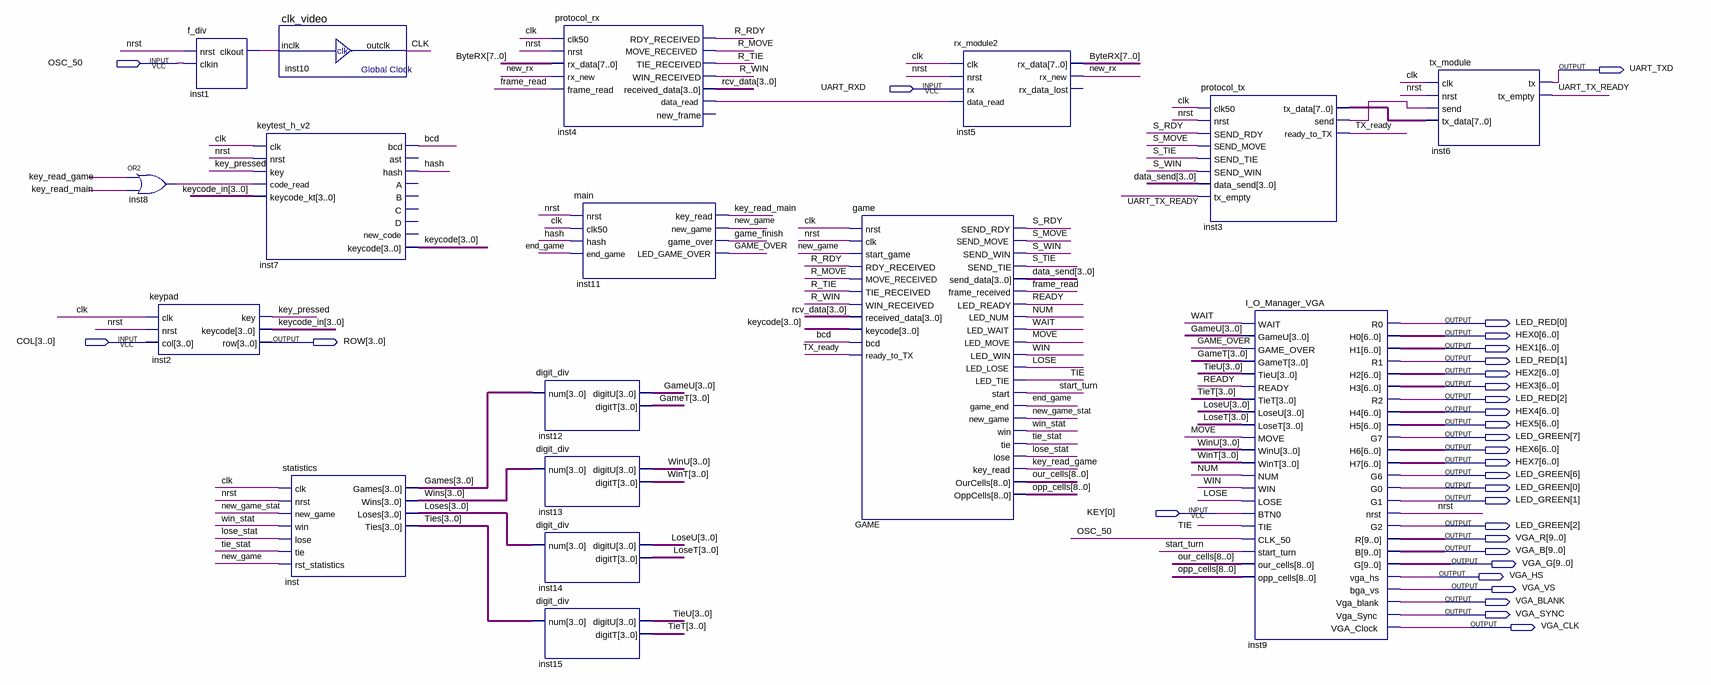
[diagram p0: schematic sheet]
// Quartus schematic P1_BOARD_vga.bdf as structural Verilog: 17 symbols, 30 pins
module P1_BOARD_vga (
  input  OSC_50,
  input  UART_RXD,
  input  [3:0] COL,
  input  [0:0] KEY,
  output UART_TXD,
  output [2:0] LED_RED,
  output [6:0] HEX0,
  output [3:0] ROW,
  output [6:0] HEX1,
  output [6:0] HEX2,
  output [6:0] HEX3,
  output [6:0] HEX4,
  output [6:0] HEX5,
  output [7:0] LED_GREEN,
  output [6:0] HEX6,
  output [6:0] HEX7,
  output [9:0] VGA_R,
  output [9:0] VGA_B,
  output [9:0] VGA_G,
  output VGA_HS,
  output VGA_VS,
  output VGA_BLANK,
  output VGA_SYNC,
  output VGA_CLK
);

  wire bcd, clk, end_game, frame_read, game_finish, GAME_OVER, hash, inst1_clkout, inst3_send,
       inst4_data_read, inst8_out, key_pressed, key_read_game, key_read_main, LOSE, lose_stat, MOVE,
       new_game, new_game_stat, new_rx, nrst, NUM, R_MOVE, R_RDY, R_TIE, R_WIN, READY, S_MOVE, S_RDY, S_TIE,
       S_WIN, start_turn, TIE, tie_stat, TX_ready, UART_TX_READY, WAIT, WIN, win_stat;
  wire [3:0] data_send, Games, GameT, GameU, keycode, keycode_in, Loses, LoseT, LoseU, rcv_data, Ties, TieT,
       TieU, Wins, WinT, WinU;
  wire [7:0] ByteRX, inst3_tx_data;
  wire [8:0] opp_cells, our_cells;

  or inst8 (inst8_out, key_read_game, key_read_main);
  f_div inst1 (.nrst(nrst), .clkin(OSC_50), .clkout(inst1_clkout));
  keypad inst2 (.clk(clk), .nrst(nrst), .col(COL), .key(key_pressed), .keycode(keycode_in), .row(ROW));
  clk_video inst10 (.inclk(inst1_clkout), .outclk(clk));
  keytest_h_v2 inst7 (
    .clk(clk), .nrst(nrst), .key(key_pressed), .code_read(inst8_out), .keycode_kt(keycode_in), .bcd(bcd),
    .hash(hash), .keycode(keycode));  // open: ast, A, B, C, D, new_code
  statistics inst (
    .clk(clk), .nrst(nrst), .new_game(new_game_stat), .win(win_stat), .lose(lose_stat), .tie(tie_stat),
    .rst_statistics(new_game), .Games(Games), .Wins(Wins), .Loses(Loses), .Ties(Ties));
  digit_div inst12 (.num(Games), .digitU(GameU), .digitT(GameT));
  digit_div inst13 (.num(Wins), .digitU(WinU), .digitT(WinT));
  digit_div inst14 (.num(Loses), .digitU(LoseU), .digitT(LoseT));
  digit_div inst15 (.num(Ties), .digitU(TieU), .digitT(TieT));
  protocol_rx inst4 (
    .clk50(clk), .nrst(nrst), .rx_data(ByteRX), .rx_new(new_rx), .frame_read(frame_read),
    .RDY_RECEIVED(R_RDY), .MOVE_RECEIVED(R_MOVE), .TIE_RECEIVED(R_TIE), .WIN_RECEIVED(R_WIN),
    .received_data(rcv_data), .data_read(inst4_data_read));  // open: new_frame
  main inst11 (
    .nrst(nrst), .clk50(clk), .hash(hash), .end_game(end_game), .key_read(key_read_main),
    .new_game(new_game), .game_over(game_finish), .LED_GAME_OVER(GAME_OVER));
  game GAME (
    .nrst(clk), .clk(nrst), .start_game(new_game), .RDY_RECEIVED(R_RDY), .MOVE_RECEIVED(R_MOVE),
    .TIE_RECEIVED(R_TIE), .WIN_RECEIVED(R_WIN), .received_data(rcv_data), .keycode(keycode), .bcd(bcd),
    .ready_to_TX(TX_ready), .SEND_RDY(S_RDY), .SEND_MOVE(S_MOVE), .SEND_WIN(S_WIN), .SEND_TIE(S_TIE),
    .send_data(data_send), .frame_received(frame_read), .LED_READY(READY), .LED_NUM(NUM), .LED_WAIT(WAIT),
    .LED_MOVE(MOVE), .LED_WIN(WIN), .LED_LOSE(LOSE), .LED_TIE(TIE), .start(start_turn), .game_end(end_game),
    .new_game(new_game_stat), .win(win_stat), .tie(tie_stat), .lose(lose_stat), .key_read(key_read_game),
    .OurCells(our_cells), .OppCells(opp_cells));
  rx_module2 inst5 (
    .clk(clk), .nrst(nrst), .rx(UART_RXD), .data_read(inst4_data_read), .rx_data(ByteRX), .rx_new(new_rx));  // open: rx_data_lost
  protocol_tx inst3 (
    .clk50(clk), .nrst(nrst), .SEND_RDY(S_RDY), .SEND_MOVE(S_MOVE), .SEND_TIE(S_TIE), .SEND_WIN(S_WIN),
    .data_send(data_send), .tx_empty(UART_TX_READY), .tx_data(inst3_tx_data), .send(inst3_send),
    .ready_to_TX(TX_ready));
  I_O_Manager_VGA inst9 (
    .WAIT(WAIT), .GameU(GameU), .GAME_OVER(GAME_OVER), .GameT(GameT), .TieU(TieU), .READY(READY),
    .TieT(TieT), .LoseU(LoseU), .LoseT(LoseT), .MOVE(MOVE), .WinU(WinU), .WinT(WinT), .NUM(NUM), .WIN(WIN),
    .LOSE(LOSE), .BTN0(KEY[0]), .TIE(TIE), .CLK_50(OSC_50), .start_turn(start_turn), .our_cells(our_cells),
    .opp_cells(opp_cells), .R0(LED_RED[0]), .H0(HEX0), .H1(HEX1), .R1(LED_RED[1]), .H2(HEX2), .H3(HEX3),
    .R2(LED_RED[2]), .H4(HEX4), .H5(HEX5), .G7(LED_GREEN[7]), .H6(HEX6), .H7(HEX7), .G6(LED_GREEN[6]),
    .G0(LED_GREEN[0]), .G1(LED_GREEN[1]), .nrst(nrst), .G2(LED_GREEN[2]), .R(VGA_R), .B(VGA_B), .G(VGA_G),
    .vga_hs(VGA_HS), .bga_vs(VGA_VS), .Vga_blank(VGA_BLANK), .Vga_Sync(VGA_SYNC), .VGA_Clock(VGA_CLK));
  tx_module inst6 (
    .clk(clk), .nrst(nrst), .send(inst3_send), .tx_data(inst3_tx_data), .tx(UART_TXD),
    .tx_empty(UART_TX_READY));
endmodule
